# EAGLE design GettingStarted (EAGLE 9.6.2)
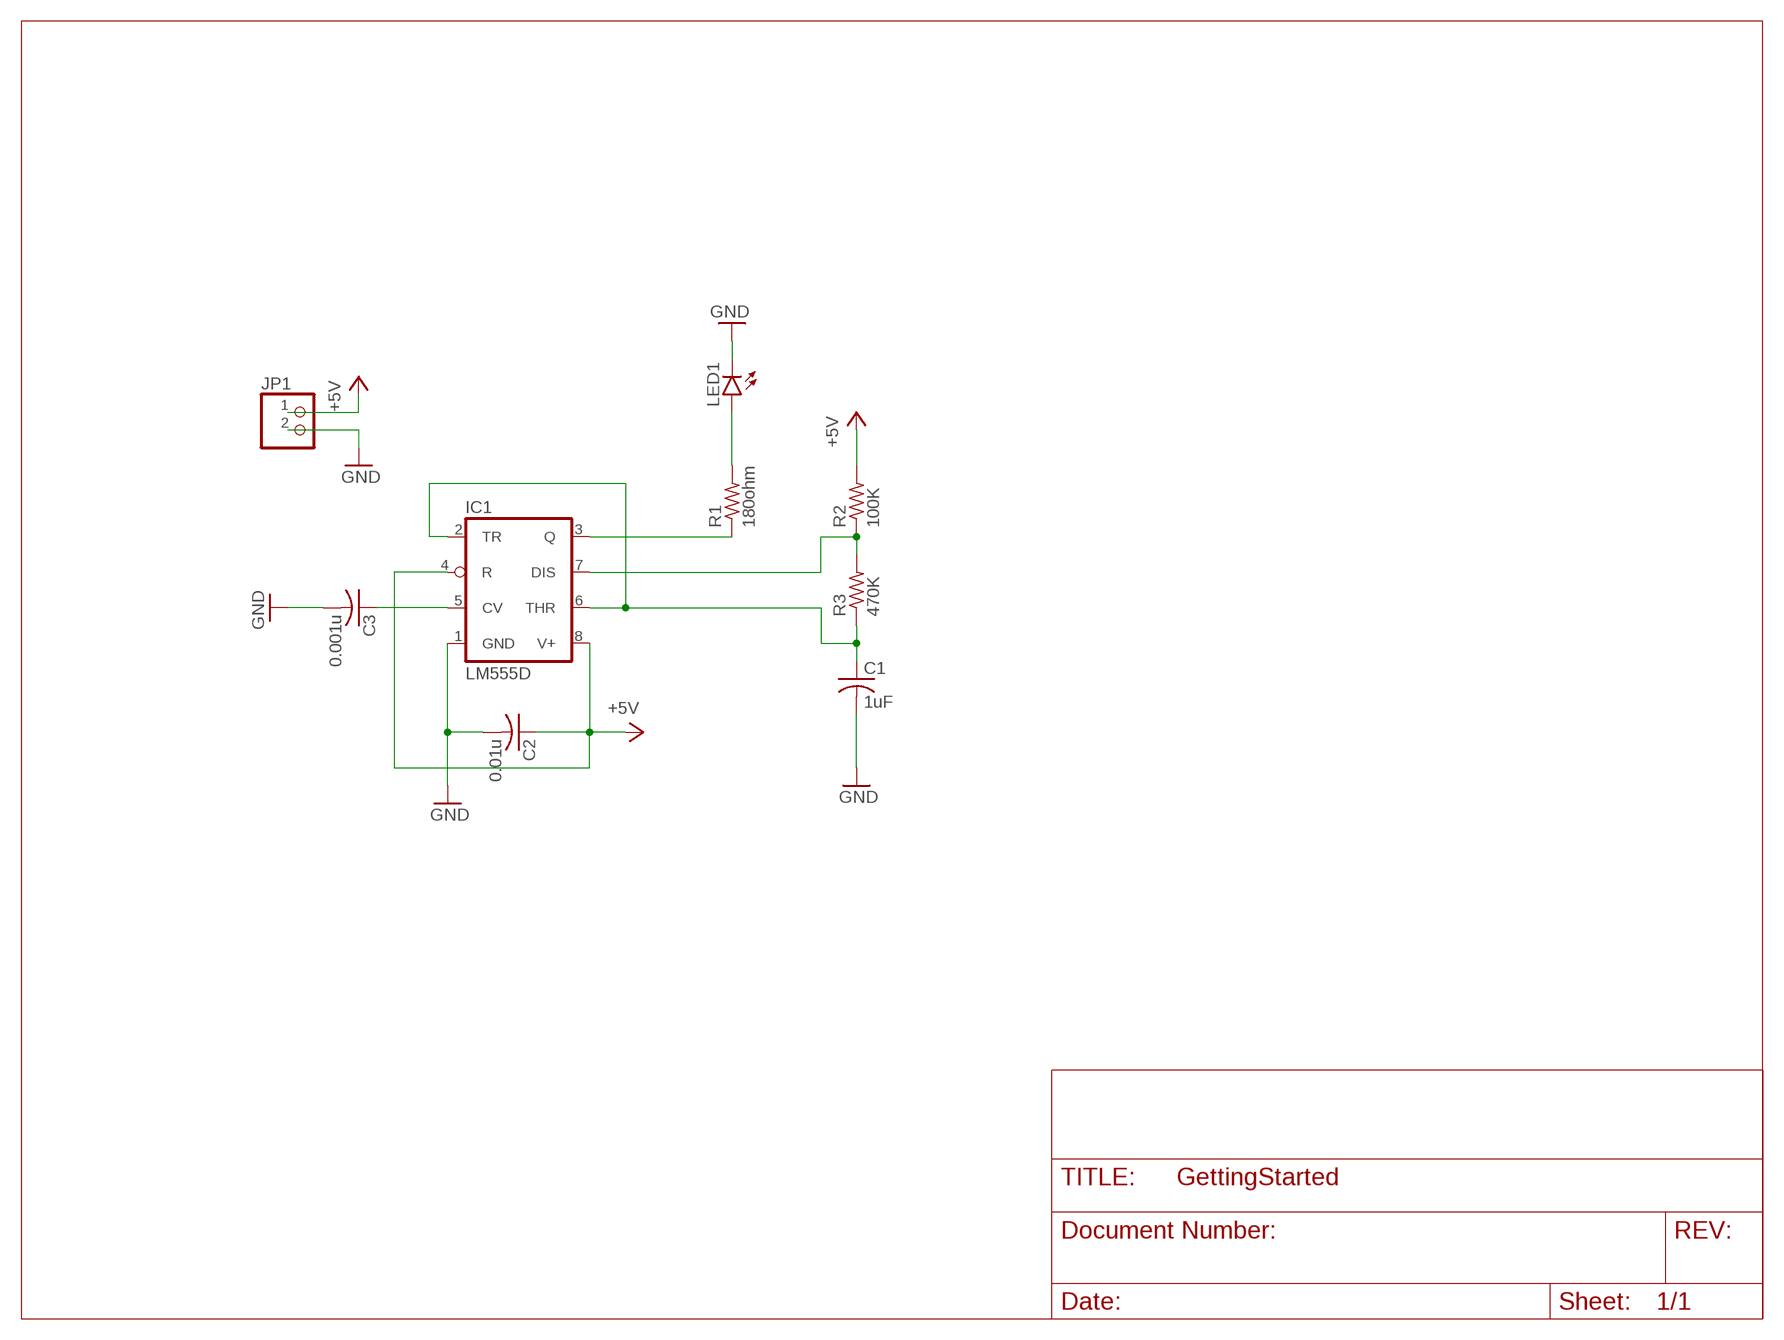
[diagram p0: schematic, sheet 1]

## Parts
C1  1uF  C-USC0805  [C0805]
C2  0.01u  C-USC0805  [C0805]
C3  0.001u  C-USC0805  [C0805]
IC1  LM555D  [SO08]
JP1  PINHD-1X2  [1X02]
LED1  LED5MM  [LED5MM]
R1  180ohm  R-US_R0805  [R0805]
R2  100K  R-US_R0805  [R0805]
R3  470K  R-US_R0805  [R0805]

## Nets
+5V: C2.1 IC1.4(R) IC1.8(V+) JP1.1 R2.2
GND: C1.2 C2.2 C3.2 IC1.1(GND) JP1.2 LED1.K(C)
N$1: IC1.3(Q) R1.1
N$2: IC1.7(DIS) R2.1 R3.2
N$3: C1.1 IC1.2(TR) IC1.6(THR) R3.1
N$4: C3.1 IC1.5(CV)
N$6: LED1.A R1.2

## Library data of the parts
C1-C3 = rcl:C-US: CAPACITOR, American symbol; SPICEPREFIX: C
IC1 = linear:*555: TIMER
JP1 = pinhead:PINHD-1X2: PIN HEADER
LED1 = led:LED: LED OSRAM: - CHIPLED LG R971, LG N971, LY N971, LG Q971, LY Q971, LO R971, LY R971 LH N974, LH R974 LS Q976, LO Q976, LY Q976 LO Q996 - Hyper CHIPLED LW Q18S LB Q993, LB Q99A, LB R99A - SideLED LS A670, LO A670, LY A670, LG A670, LP A670 LB A673, LV A673, LT A673, LW A673 LH A674 LY A675 LS A676, LA A676, LO A676, LY A676, LW A676 LS A679, LY A679, LG A679 - Hyper Micro SIDELED® LS Y876, LA Y876, LO Y876, LY Y876 LT Y87S - SmartLED LW L88C, LW L88S LB L89C, LB L89S, LG L890 LS L89K, LO L89K, LY L89K LS L896, LA L896, LO L896, LY L896 - TOPLED LS T670, LO T670, LY T670, LG T670, LP T670 LSG T670, LSP T670, LSY T670, LOP T670, LYG T670 LG T671, LOG T671, LSG T671 LB T673, LV T673, LT T673, LW T673 LH T674 LS T676, LA T676, LO T676, LY T676, LB T676, LH T676, LSB T676, LW T676 LB T67C, LV T67C, LT T67C, LS T67K, LO T67K, LY T67K, LW E67C LS E67B, LA E67B, LO E67B, LY E67B, LB E67C, LV E67C, LT E67C LW T67C LS T679, LY T679, LG T679 LS T770, LO T770, LY T770, LG T770, LP T770 LB T773, LV T773, LT T773, LW T773 LH T774 LS E675, LA E675, LY E675, LS T675 LS T776, LA T776, LO T776, LY T776, LB T776 LHGB T686 LT T68C, LB T68C - Hyper Mini TOPLED® LB M676 - Mini TOPLED Santana® LG M470 LS M47K, LO M47K, LY M47K Source: http://www.osram.convergy.de LUXEON: - LUMILED® LXK2-PW12-R00, LXK2-PW12-S00, LXK2-PW14-U00, LXK2-PW14-V00 LXK2-PM12-R00, LXK2-PM12-S00, LXK2-PM14-U00 LXK2-PE12-Q00, LXK2-PE12-R00, LXK2-PE12-S00, LXK2-PE14-T00, LXK2-PE14-U00 LXK2-PB12-K00, LXK2-PB12-L00, LXK2-PB12-M00, LXK2-PB14-N00, LXK2-PB14-P00, LXK2-PB14-Q00 LXK2-PR12-L00, LXK2-PR12-M00, LXK2-PR14-Q00, LXK2-PR14-R00 LXK2-PD12-Q00, LXK2-PD12-R00, LXK2-PD12-S00 LXK2-PH12-R00, LXK2-PH12-S00 LXK2-PL12-P00, LXK2-PL12-Q00, LXK2-PL12-R00 Source: www.luxeon.com KINGBRIGHT: KA-3528ASYC Source: www.kingbright.com
R1-R3 = rcl:R-US_: RESISTOR, American symbol; SPICEPREFIX: R

## Board
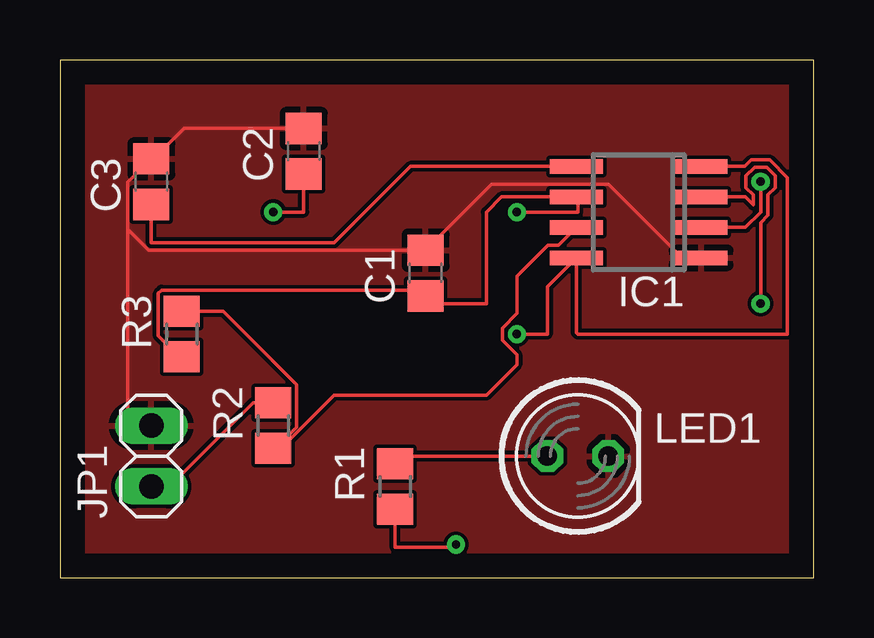
[diagram p1: board, top side]
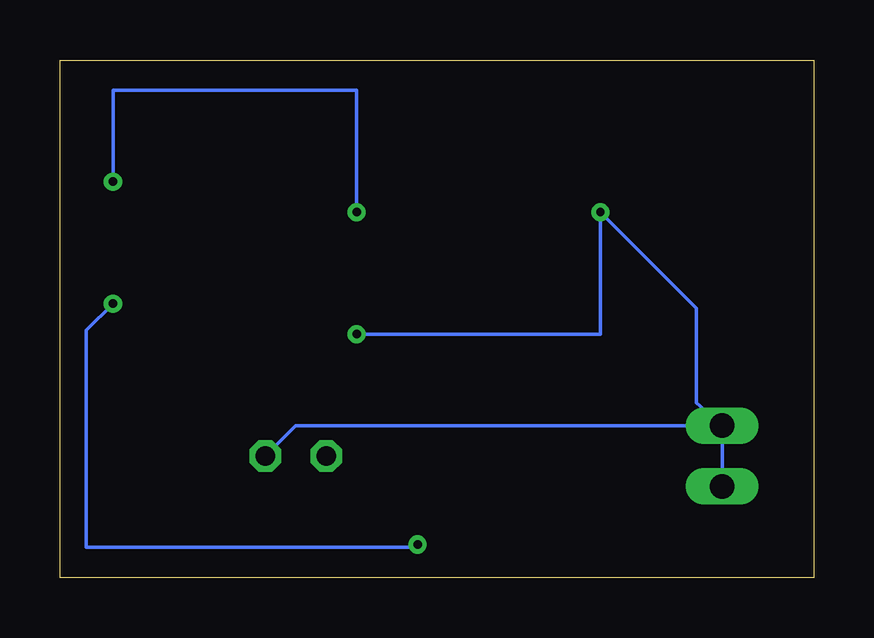
[diagram p2: board, bottom side, seen from below]

Size 31.42 x 21.58 mm. Coordinates in mm from the lower left corner, seen from the top.
Outline: 0,0 31.42,0 31.42,21.58 0,21.58 0,0
Copper layers (1*16): Top 0.035mm / dielectric 1.5mm / Bottom 0.035mm
Design rules "default": minimum track width 6mil, minimum drill 0.35mm, track to track 6mil, track to pad 6mil, pad to pad 6mil, via to via 6mil, smd to smd 6mil, copper to edge 40mil, drill to drill 6mil, minimum pad ring 10mil, minimum via ring 8mil, stop-mask expansion 4mil, vias tented up to drill 0mil, thermal gap 10mil

### Footprints (pad centres in the part's own frame; a part is rotated, then mirrored left to right if it is on the bottom)
C0805 = smd 1.3 x 1.5: 1 -0.95,0; 2 0.95,0
SO08 = smd 0.6 x 2.2: 1 -1.905,-2.6; 2 -0.635,-2.6; 3 0.635,-2.6; 4 1.905,-2.6; 5 1.905,2.6; 6 0.635,2.6; 7 -0.635,2.6; 8 -1.905,2.6
1X02 = drill 1.016 long: 1 -1.27,0; 2 1.27,0
LED5MM = drill 0.813 octagon: A -1.27,0; K 1.27,0
R0805 = smd 1.3 x 1.5: 1 -0.95,0; 2 0.95,0

### Placement (x,y rotation side)
C1  15.24,12.7 90 top
C2  10.16,17.78 90 top
C3  3.81,16.51 90 top
IC1  24.13,15.24 90 top
JP1  3.81,5.08 90 top
LED1  21.59,5.08 0 top
R1  13.97,3.81 90 top
R2  8.89,6.35 90 top
R3  5.08,10.16 90 top

### Tracks (layer width: path | path; a pad name or v marks a point on that pad's centre or on a via)
+5V  (via drill 0.35)
  Top 0.152: v19.05,10.16 20.32,10.16 20.32,12.12 IC1.8 21.53,10.22 21.59,10.16 30.33,10.16 30.33,16.68 29.59,17.42 28.83,17.42 28.56,17.14 IC1.4 | v8.89,15.24 10.16,15.24 C2.1 | R2.2 8.06,7.3 4.57,3.81 JP1.1
  Bottom 0.152: v19.05,10.16 8.89,10.16 v8.89,15.24 4.89,11.24 4.89,7.3 3.81,6.35 3.81,4.57 4.57,3.81 JP1.1
GND
  Top 0.152: C2.2 5.18,18.73 3.91,17.46 C3.2 | JP1.2 3.05,6.35 2.83,6.57 2.83,16.48 | 2.83,16.48 C3.2 | 2.83,16.48 2.83,14.52 3.7,13.65 C1.2 17.99,16.4 22.86,16.4 25.93,13.33 IC1.1 | 2.83,16.48 C3.2
  Bottom 0.152: LED1.K 21.59,6.35 4.57,6.35 JP1.2
  pour Top: 0,21.59 31.75,21.59 31.75,0 0,0
N$1  (via drill 0.35)
  Top 0.152: IC1.3 28.57,15.87 28.91,15.54 28.91,15.96 28.6,16.26 28.6,16.76 28.96,17.12 29.46,17.12 29.82,16.76 29.82,16.26 29.52,15.96 29.52,15.11 29.21,14.81 v29.21,11.43 | v16.51,1.39 16.39,1.27 13.97,1.27 R1.1
  Bottom 0.152: v29.21,11.43 30.33,10.31 30.33,1.27 16.51,1.27 v16.51,1.39
N$2
  Top 0.152: IC1.7 20.79,13.86 20.34,13.86 19.05,12.58 19.05,11.02 18.44,10.41 18.44,9.91 19.05,9.3 19.05,8.89 17.78,7.62 11.43,7.62 8.89,5.08 R2.1 8.99,5.4 9.87,6.28 9.87,8.04 6.8,11.11 R3.2
N$3  (via drill 0.35)
  Top 0.152: IC1.2 28.57,14.6 29.21,15.24 v29.21,16.51 | v19.05,15.24 21.59,15.24 21.59,15.81 IC1.6 18.41,15.87 17.78,15.24 17.78,11.43 15.56,11.43 C1.1 15,11.99 4.24,11.99 4.1,11.85 4.1,10.09 4.98,9.21 R3.1
  Bottom 0.152: v19.05,15.24 19.05,20.32 29.21,20.32 v29.21,16.51
N$4
  Top 0.152: IC1.5 14.6,17.14 11.43,13.97 3.81,13.97 C3.1
N$6
  Top 0.152: LED1.A 14.29,5.08 R1.2